# Altium project HARDWARE_HOME_5BUTTON_ALTIUM.PrjPcb
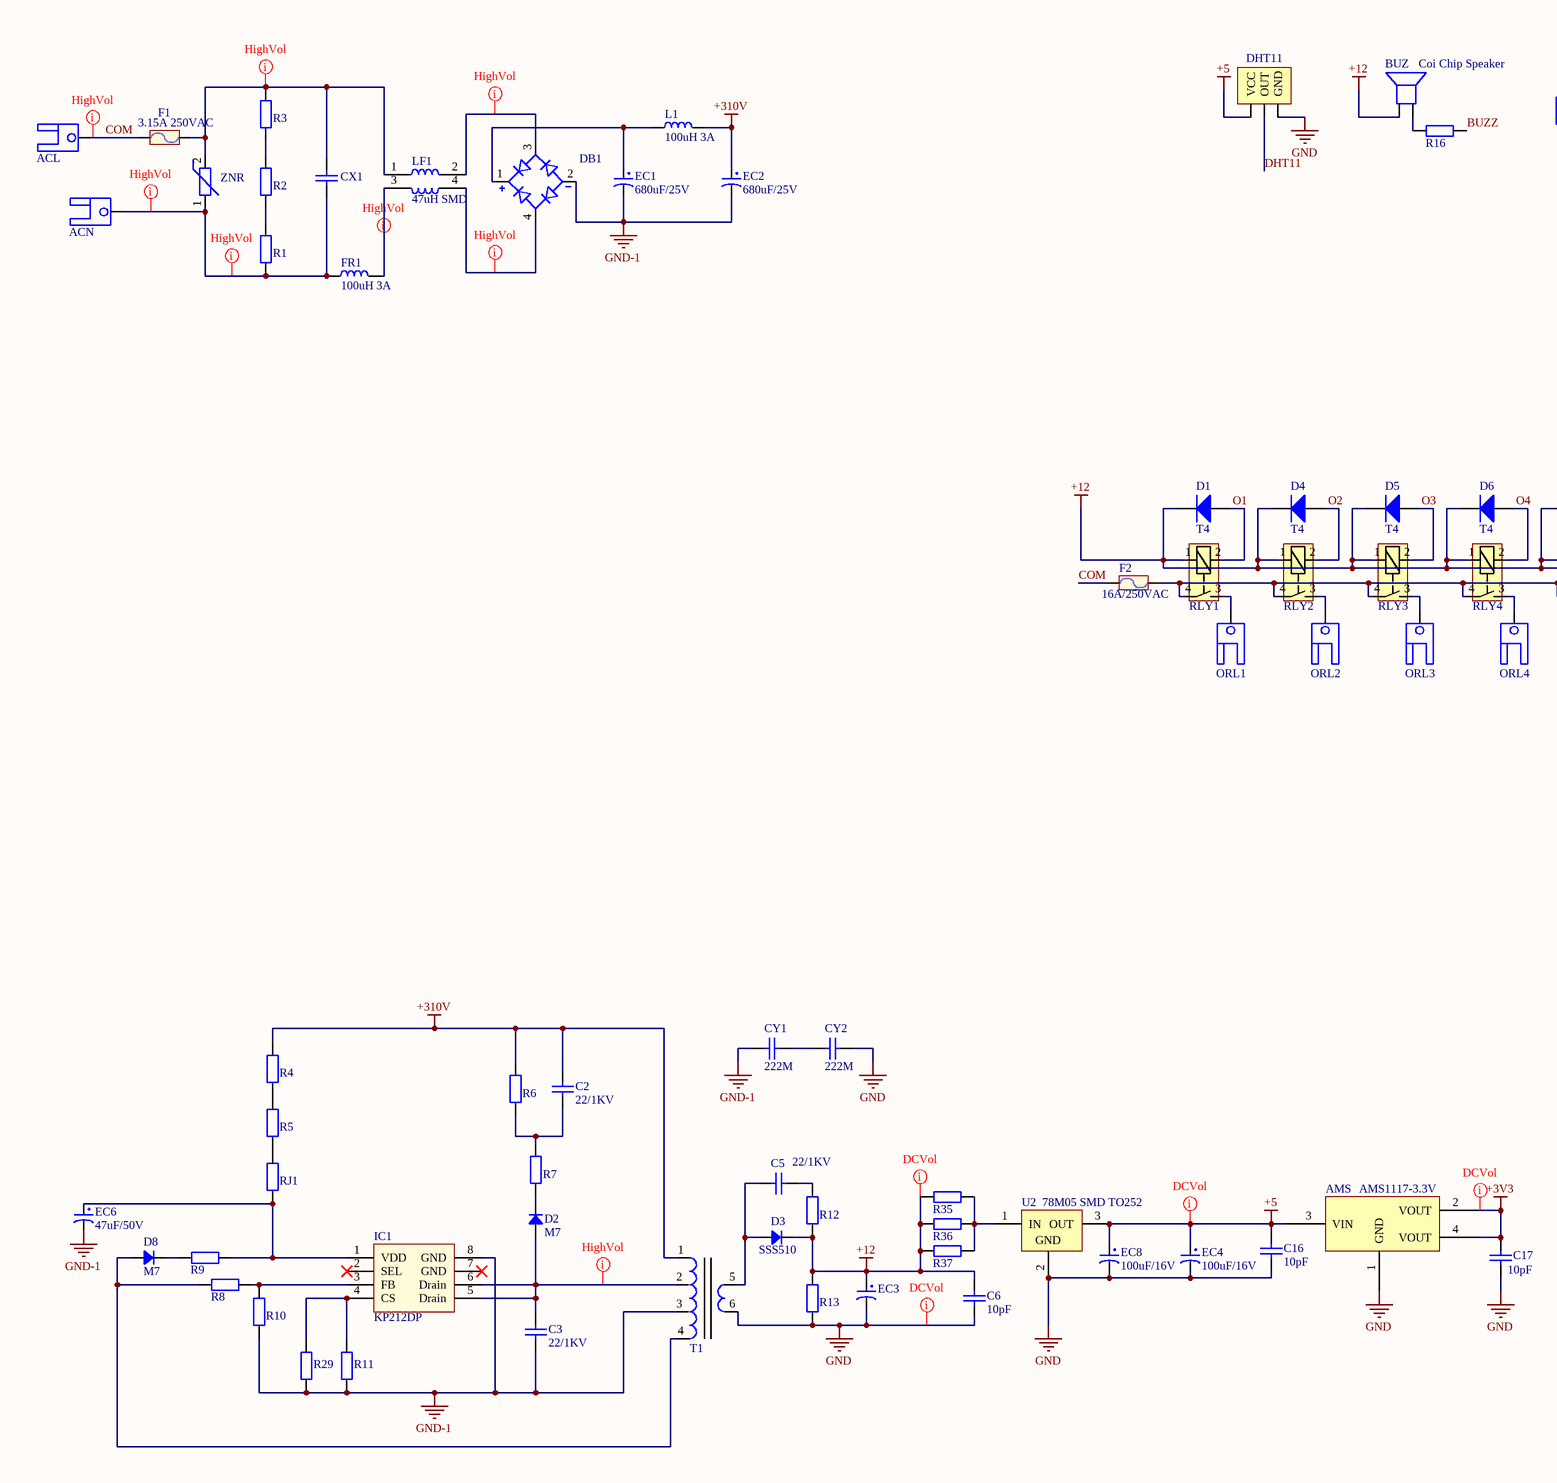
[diagram p0: Hardware5button.SchDoc, left]
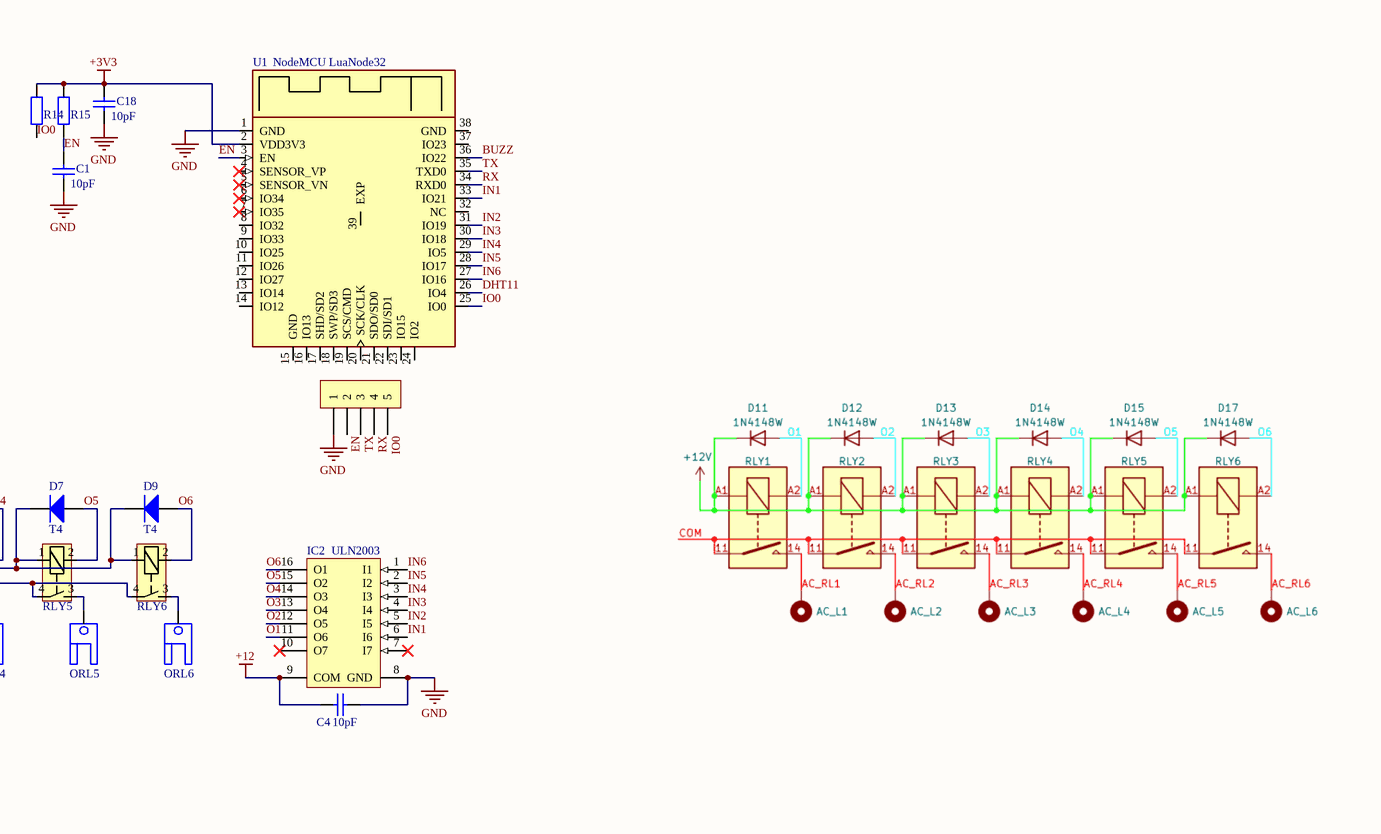
[diagram p1: Hardware5button.SchDoc, right]
1 sheet, 78 parts. Net scope: global (net labels, ports and power ports of the same name join across sheets).
Board file: CAMtastic1_2.PcbDoc

## Sheet Hardware5button.SchDoc
size A3; SheetNumber: 1; SheetTotal: 1

### Parts
ACL  1217861-1  [CON1_P192_70D137_TH_ST]  (value not drawn)
ACN  1217861-1  [CON1_P192_70D137_TH_ST]  (value not drawn)
AMS  AMS1117-3.3V  [SOT223]
BUZ  Coi Chip Speaker  [Coi 14mm]
C1  10pF  [tu 0805]
C2  22/1KV  [TU GOM CAO AP]
C3  22/1KV  [TU GOM CAO AP]
C4  10pF  [tu 0805]
C5  22/1KV  [TU GOM CAO AP]
C6  10pF  [tu 0805]
C16  10pF  [tu 0805]
C17  10pF  [tu 0805]
C18  10pF  [tu 0805]
CX1  0.1  [Tu vuong 10mm]  (value not drawn)
CY1  222M  [TU GOM CAO AP 222M]
CY2  222M  [TU GOM CAO AP 222M]
D1  T4  [DIODE SOD-123]
D2  M7  [DIODE SMA]
D3  SSS510  [DIODE SMA]
D4  T4  [DIODE SOD-123]
D5  T4  [DIODE SOD-123]
D6  T4  [DIODE SOD-123]
D7  T4  [DIODE SOD-123]
D8  M7  [DIODE SMA]
D9  T4  [DIODE SOD-123]
DB1  MLB10S  [MBLS-1]  (value not drawn)
DHT11  1x3 2.54  [DHT11]  (value not drawn)
EC1  680uF/25V  [tu hoa 10mm]
EC2  680uF/25V  [tu hoa 10mm]
EC3  10UF/400V  [tu hoa 10mm]  (value not drawn)
EC4  100uF/16V  [tu hoa 5mm]
EC6  47uF/50V  [tu hoa 5mm]
EC8  100uF/16V  [tu hoa 5mm]
F1  3.15A 250VAC  [Cau chi 2A 250V T2A250V]
F2  16A/250VAC  [Cau Chi 250V]
FR1  100uH 3A  [CUON CAM - duplicate]
H1  Header 5P 2.54 DT  [XH2.54M-5]  (value not drawn)
IC1  KP212DP  [DIP8]
IC2  ULN2003  [SOP 16]
L1  100uH 3A  [CUON CAM - duplicate]
LF1  47uH SMD  [Cuon Cam AC-AC]
ORL1  1217861-1  [CON1_P192_70D137_TH_ST]  (value not drawn)
ORL2  1217861-1  [CON1_P192_70D137_TH_ST]  (value not drawn)
ORL3  1217861-1  [CON1_P192_70D137_TH_ST]  (value not drawn)
ORL4  1217861-1  [CON1_P192_70D137_TH_ST]  (value not drawn)
ORL5  1217861-1  [CON1_P192_70D137_TH_ST]  (value not drawn)
ORL6  1217861-1  [CON1_P192_70D137_TH_ST]  (value not drawn)
R1  0.68R  [tro smd 1206]  (value not drawn)
R2  0.68R  [tro smd 1206]  (value not drawn)
R3  0.68R  [tro smd 1206]  (value not drawn)
R4  0.68R  [tro smd 1206]  (value not drawn)
R5  0.68R  [tro smd 1206]  (value not drawn)
R6  0.68R  [tro smd 1206]  (value not drawn)
R7  0.68R  [tro smd 1206]  (value not drawn)
R8  0.22R  [tro smd 0805]  (value not drawn)
R9  0.68R  [tro smd 1206]  (value not drawn)
R10  0.22R  [tro smd 0805]  (value not drawn)
R11  0.68R  [tro smd 1206]  (value not drawn)
R12  0.68R  [tro smd 1206]  (value not drawn)
R13  0.22R  [tro smd 0805]  (value not drawn)
R14  0.22R  [tro smd 0805]  (value not drawn)
R15  0.22R  [tro smd 0805]  (value not drawn)
R16  0.22R  [tro smd 0805]  (value not drawn)
R29  0.68R  [tro smd 1206]  (value not drawn)
R35  0.68R  [tro smd 1206]  (value not drawn)
R36  0.68R  [tro smd 1206]  (value not drawn)
R37  0.68R  [tro smd 1206]  (value not drawn)
RJ1  0.68R  [tro smd 1206]  (value not drawn)
RLY1  Relay JZC-8F-1H  [Relay 4 chan JZC-8F]  (value not drawn)
RLY2  Relay JZC-8F-1H  [Relay 4 chan JZC-8F]  (value not drawn)
RLY3  Relay JZC-8F-1H  [Relay 4 chan JZC-8F]  (value not drawn)
RLY4  Relay JZC-8F-1H  [Relay 4 chan JZC-8F]  (value not drawn)
RLY5  Relay JZC-8F-1H  [Relay 4 chan JZC-8F]  (value not drawn)
RLY6  Relay JZC-8F-1H  [Relay 4 chan JZC-8F]  (value not drawn)
T1  Bien ap  [BIEN AP EE1610-12V1.1A]  (value not drawn)
U1  NodeMCU LuaNode32  [ESP32-WROOM-32D]
U2  78M05 SMD TO252  [TO252]
ZNR  MOV-07D471KTR  [Tu MOV - duplicate]  (value not drawn)

### Nets
+3V3: AMS.2(VOUT) AMS.4(VOUT) C17.1 C18.1 R14.2 R15.2 U1.2(VDD3V3)
+5: AMS.3(VIN) C16.1 DHT11.1(VCC) EC4.1 EC8.1 U2.3(OUT)
+12: BUZ.1 C4.1 C6.1 D1.2(K) D3.2(K) D4.2(K) D5.2(K) D6.2(K) D7.2(K) D9.2(K) EC3.1 IC2.9(COM) R12.1 R13.2 R35.2 R36.2 R37.2 RLY1.1 RLY2.1 RLY3.1 RLY4.1 RLY5.1 RLY6.1
+310V: C2.1 EC2.1 L1.2 R4.2 R6.2 T1.1
GND: AMS.1(GND) C1.2 C4.2 C6.2 C16.2 C17.2 C18.2 CY2.1 DHT11.3(GND) EC3.2 EC4.2 EC8.2 H1.1 IC2.8(GND) R13.1 T1.6 U1.1(GND) U2.2(GND)
GND-1: C3.2 CY1.2 DB1.2(NEG) EC1.2 EC2.2 EC6.2 IC1.8(GND) R10.1 R11.1 R29.1 T1.3
BUZZ: R16.1 U1.36(IO22)
COM: ACL.1 F1.1 F2.1
DHT11: DHT11.2(OUT) U1.26(IO4)
EN: C1.1 H1.2 R15.1 U1.3(EN)
IN1: IC2.6(I6) U1.33(IO21)
IN2: IC2.5(I5) U1.31(IO19)
IN3: IC2.4(I4) U1.30(IO18)
IN4: IC2.3(I3) U1.29(IO5)
IN5: IC2.2(I2) U1.28(IO17)
IN6: IC2.1(I1) U1.27(IO16)
IO0: H1.5 R14.1 U1.25(IO0)
O1: D1.1(A) IC2.11(O6) RLY1.2
O2: D4.1(A) IC2.12(O5) RLY2.2
O3: D5.1(A) IC2.13(O4) RLY3.2
O4: D6.1(A) IC2.14(O3) RLY4.2
O5: D7.1(A) IC2.15(O2) RLY5.2
O6: D9.1(A) IC2.16(O1) RLY6.2
RX: H1.4 U1.34(RXD0)
TX: H1.3 U1.35(TXD0)
NetACN_1: ACN.1 CX1.2 FR1.1 R1.1 ZNR.1
NetBUZ_2: BUZ.2 R16.2
NetC2_2: C2.2 R6.1 R7.2
NetC3_1: C3.1 D2.1(A) IC1.5(Drain) IC1.6(Drain) T1.2
NetC5_1: C5.1 D3.1(A) T1.5
NetC5_2: C5.2 R12.2
NetCX1_1: CX1.1 F1.2 LF1.1 R3.2 ZNR.2
NetCY1_1: CY1.1 CY2.2
NetD2_2: D2.2(K) R7.1
NetD8_1: D8.1(A) R8.1 T1.4
NetD8_2: D8.2(K) R9.2
NetDB1_1: DB1.1(POS) EC1.1 L1.1
NetDB1_3: DB1.3(AC2) LF1.2
NetDB1_4: DB1.4(AC1) LF1.4
NetEC6_1: EC6.1 IC1.1(VDD) R9.1 RJ1.1
NetF2_2: F2.2 RLY1.4(AC/DC) RLY2.4(AC/DC) RLY3.4(AC/DC) RLY4.4(AC/DC) RLY5.4(AC/DC) RLY6.4(AC/DC)
NetFR1_2: FR1.2 LF1.3
NetIC1_3: IC1.3(FB) R8.2 R10.2
NetIC1_4: IC1.4(CS) R11.2 R29.2
NetORL1_1: ORL1.1 RLY1.3(AC/DC)
NetORL2_1: ORL2.1 RLY2.3(AC/DC)
NetORL3_1: ORL3.1 RLY3.3(AC/DC)
NetORL4_1: ORL4.1 RLY4.3(AC/DC)
NetORL5_1: ORL5.1 RLY5.3(AC/DC)
NetORL6_1: ORL6.1 RLY6.3(AC/DC)
NetR1_2: R1.2 R2.1
NetR2_2: R2.2 R3.1
NetR4_1: R4.1 R5.2
NetR5_1: R5.1 RJ1.2
NetR35_1: R35.1 R36.1 R37.1 U2.1(IN)

Not connected (* = marked no-connect by the designer): IC1 2(SEL)* 7(GND)*; IC2 7(I7)* 10(O7)*; U1 4(SENSOR_VP)* 5(SENSOR_VN)* 6(IO34)* 7(IO35)* 8(IO32) 9(IO33) 10(IO25) 11(IO26) 12(IO27) 13(IO14) 14(IO12) 15(GND) 16(IO13) 17(SHD/SD2) 18(SWP/SD3) 19(SCS/CMD) 20(SCK/CLK) 21(SDO/SD0) 22(SDI/SD1) 23(IO15) 24(IO2) 32(NC) 37(IO23) 38(GND) 39(EXP)

### Layout directives
net class HighVol: COM, NetACN_1, NetC3_1, NetCX1_1, NetDB1_3, NetDB1_4, NetFR1_2
net class DCVol: +3V3, +5, +12, GND

### Library data of the parts
ACL ACN ORL1-ORL6 = CON-PLG-SPADE_1X1-256-ST-TH: 1 Pins, 1 Row 256mil Pitch, Straight, Male; Manufacturer: TE Connectivity; Mating Part Number: 2-520183-2; Alternate Part Number-1: NA; Manufacturer Part Number: 1217861-1; Case/Package: TH-CON; Supplier-1: ARROW; Supplier Part Number-1: 1217861-1
AMS = AMS1117 SMD: Dán; Value: AMS1117-3.3V SOT223; Don_Vi: Con; Ma_Hang: MH000596; Ghi_Chu: *; Kieu_Chan: *; Chung_Loai: Dán
BUZ = Coi 14mm: Cắm
C1 C4 C6 C16-C18 = Tu 0805 10pF 50V 10%: Dán; Don_Vi: Con; So_Chan: 2; Ten_Linh_Kien: Tụ 0805 10P 10% 50V; Ma_Hang: MH004554; Chung_Loai: Dán; Kieu_Chan: *
C2 C3 C5 = Tu gom CAO AP: Cắm; Don_Vi: Con; So_Chan: 2; Ten_Linh_Kien: Tụ gốm 15P 50V; Ma_Hang: MH004767; Chung_Loai: Cắm; Kieu_Chan: *
CX1 = Tu MKP X2 0.1uF 275VAC 10MM: Cắm; Don_Vi: Con; So_Chan: 2; Ten_Linh_Kien: Tụ tantalum 224-0.22uF 50V DIP5.08 sứ vàng; Ma_Hang: MH007473; Chung_Loai: Cắm; Kieu_Chan: *
CY1 CY2 = Tu gom CAO AP 222M: Cắm; Don_Vi: Con; So_Chan: 2; Ten_Linh_Kien: Tụ gốm 15P 50V; Ma_Hang: MH004767; Chung_Loai: Cắm; Kieu_Chan: *
D1 D4-D7 D9 = Diode S4: Dán; Ten_Linh_Kien: Diode S4 SOD123 ( 1N5819 SOD123); Ma_Hang: MH005519; Don_Vi: Con; Ghi_Chu: *; Chung_Loai: Dán; Kieu_Chan: *
D2 D3 D8 = Diode M7 1N4007 SMD 1A 1000V: Dán; Don_Vi: Con; Ma_Hang: MH000944; Chung_Loai: Dán; Ten_Linh_Kien: Diode M7 1N4007 SMD 1A 1000V; Ghi_Chu: *
DB1 = diode cau MLB10S: DÁN
DHT11 = DHT11 Module: Cắm; Ten_Linh_Kien: Jump Đơn Cái 2.54MM 1x40P Cong; Don_Vi: Con; Ma_Hang: MH001265; Ghi_Chu: *; Kieu_Chan: *; Chung_Loai: Cắm
EC1 EC2 = Tu Hoa 6.8uF 400V 10x17: Cắm; Don_Vi: Con; So_Chan: 2; Ten_Linh_Kien: Tụ Hóa 6.8uF 400V 10x17MM; Ma_Hang: MH003745; Chung_Loai: Cắm; Kieu_Chan: *
EC3 = Tu Hoa 1000uF 10V 10x12: Cắm; So_Chan: 2; Don_Vi: Con; Ten_Linh_Kien: Tụ Hóa 1000uF 10V 10x12MM; Ma_Hang: MH006614; Kieu_Chan: *; Chung_Loai: Cắm
EC4 EC8 = Tu Hoa 330uF 10V 6x11: Cắm; Don_Vi: Con; So_Chan: 2; Ten_Linh_Kien: Tụ Hóa 330uF 10V 6x11MM; Ma_Hang: MH008830; Chung_Loai: Cắm; Kieu_Chan: *
EC6 = Tu Hoa 47uF 16V 5x10: Cắm; Don_Vi: Con; So_Chan: 2; Ten_Linh_Kien: Tụ Hóa 47uF 16V; Ma_Hang: MH006859; Chung_Loai: Cắm; Kieu_Chan: *
F1 = Cau chi 2A 250V T2A250V_1: Cắm; Ma_Hang: MH010033; Ten: Cầu Chì Tự Phục Hồi 2A 24V SMD1812
F2 = Cau chi 16A 250V: Cắm; Ma_Hang: MH010033; Ten: Cầu Chì Tự Phục Hồi 2A 24V SMD1812
FR1 L1 = CUON CAM VACH DUNG: Cắm; Chung_Loai: Dán; Don_Vi: Con; Ma_Hang: MH002209; Ten_Linh_Kien: Cuộn Cảm 100uH 3A 8x10MM; Ghi Chu: *; Kieu Chan: *
H1 = Header 5P 2.54 DT: Cắm; Ten_Linh_Kien: Header 5P XH2.54-5P Đực Thẳng; Don_Vi: Con; Ma_Hang: MH001298; Chung_Loai: Cắm
IC1 = KP212: Cắm; Ten_Linh_Kien: AT24C01 DIP8 EEPROM 1KBIT; Ma_Hang: MH002775; Don_Vi: Con; Kieu_Chan: *; Ghi_Chu: *; Chung_Loai: Cắm
IC2 = ULN2003A SMD: Dán; Ten_Linh_Kien: ULN2003 SOP16; Don_Vi: Con; Ma_Hang: MH002408; Ghi_Chu: *; Chung_Loai: Dán; Kieu_Chan: *
LF1 = CUON CAM AC_AC: Cắm; Don_Vi: Con; Chung_Loai: Dán; Ma_Hang: MH004211; Ten_Linh_Kien: Cuộn Cảm 47uH 7x7x4MM CD74R; Ghi_Chu: *; Kieu_Chan: *
R1-R7 R9 R11 R12 R29 R35-R37 RJ1 = Tro 1206: Dán; Don_Vi: Con; Ma_Hang: MH008104; Ten_linh_Kien: Trở 1206 1% 0.68R; So_Chan: 2; Chung_Loai: Dán; Kieu_Chan: *
R8 R10 R13-R16 = Tro 0805: Dán; Don_Vi: Con; So_Chan: 2; Ten_Linh_Kien: Trở 0805 1% 0.22R; Ma_Hang: MH005466; Chung_Loai: Dán; Kieu_Chan: *
RLY1-RLY6 = Relay 4 chan JZC-8F-1H: Cắm; Ten: Relay 5V5A HF46F-G 5-HS1; Ma_Hang: MH003879
T1 = Bien ap: Cắm
U1 = ESP32 WROOM 32: Dán
U2 = 78M05 SMD TO252: Dán; Don_Vi: Con; Ten_Linh_Kien: 78M05 TO252; Ma_Hang: MH001917; Ghi_Chu: *; Kieu_Chan: *; Chung_Loai: Dán
ZNR = Varistor 10D471K 470V: Cam; Manufacturer: Bourns Inc.; Voltage Rating Ac: 300V; Varistor Voltage: 423V; Clamping Current: 10A; Voltage Rating Dc: 385V; Value: 126pF; Voltage Tolerance: 10%; Clamping Voltage: 775V; Package: 0; Octopart: https://octopart.com/mov-07d471ktr-bourns-19184728; Manufacturer Part Number: MOV-07D471KTR; Lead Free: Yes; RoHS: TRUE; Automotive: No; Device Class L2: Varistors; ComponentLink2URL: https://www.bourns.com/docs/product-datasheets/mov07d.pdf?sfvrsn=86ba81fd_26; Temperature Range Low: -40°C; Device Class L1: Circuit Protection; ComponentLink2Description: Datasheet; Device Class L3: unset; Temperature: -40°C to +105°C; Height: 11mm; Category: Res; Mouser Description: Varistors 105pF 470volts 10%; Temperature Range High: +105°C; Capacitance: 126pF; Digikey Description: VARISTOR 470V 1.2KA DISC 7MM